# EAGLE design Attuino-v2a (EAGLE 7.3.0)
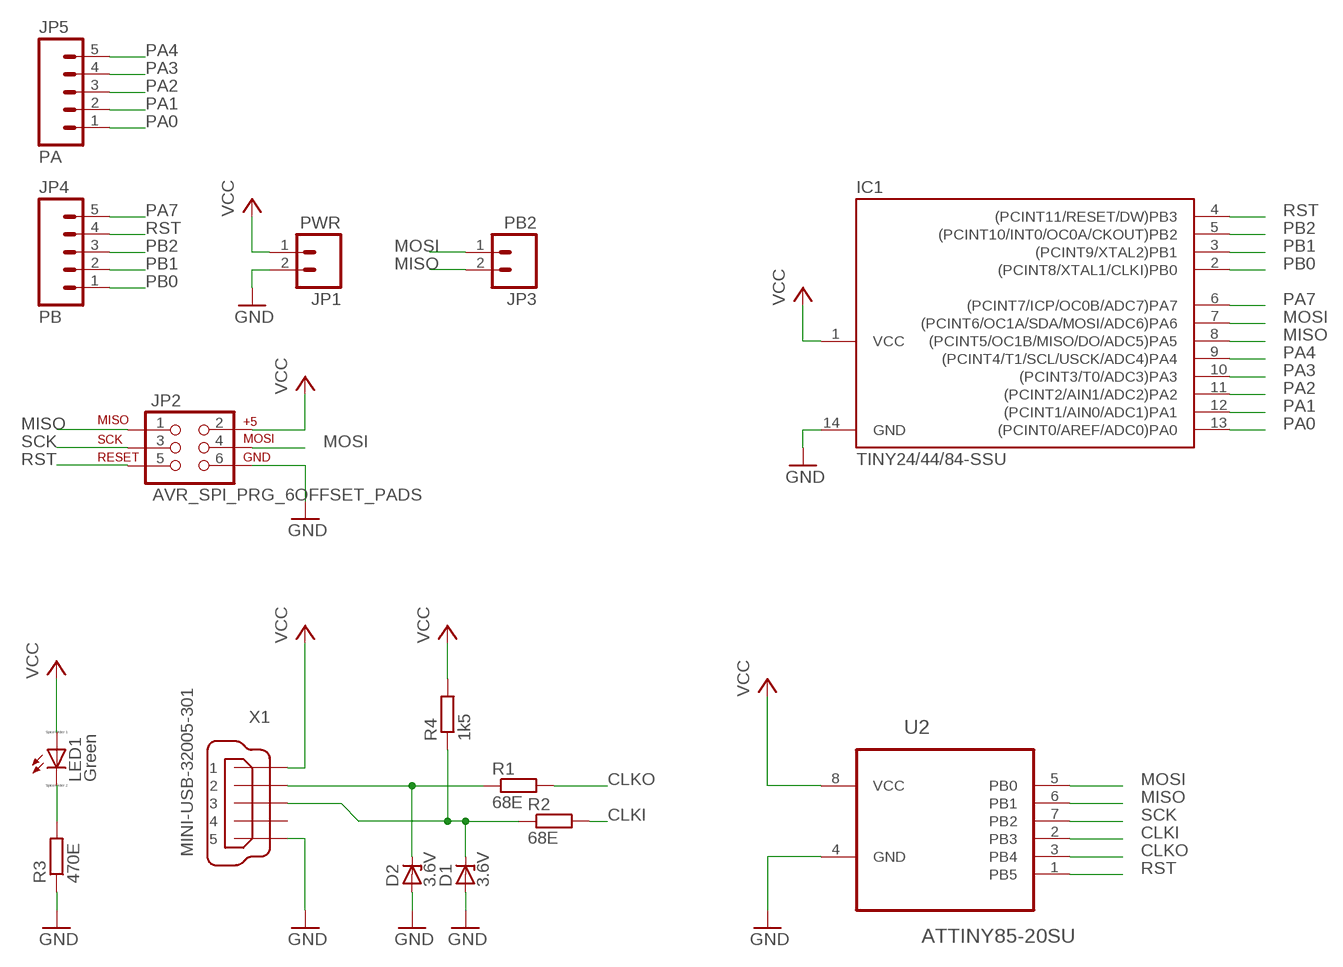
[diagram p0: schematic, sheet 1]

## Parts
D1  3.6V  ZENER-DIODESOD80C  [SOD80C]
D2  3.6V  ZENER-DIODESOD80C  [SOD80C]
IC1  TINY24/44/84-SSU  [SOIC14]
JP1  PWR  M021X02_NO_SILK  [1X02_NO_SILK]
JP2  AVR_SPI_PRG_6OFFSET_PADS  [2X3_OFFSET]
JP3  PB2  M021X02_NO_SILK  [1X02_NO_SILK]
JP4  PB  M05NO_SILK  [1X05_NO_SILK]
JP5  PA  M05NO_SILK  [1X05_NO_SILK]
LED1  Green  LED_E  [LED_1206]
R1  68E  R-EU_R0805  [R0805]
R2  68E  R-EU_R0805  [R0805]
R3  470E  R-EU_R0805  [R0805]
R4  1k5  R-EU_R0805  [R0805]
U2  ATTINY85-20SU  [SOIC127P798X216-8N]
X1  MINI-USB-32005-301  [32005-301]

## Nets
CLKI: R2.2 U2.2(PB3)
CLKO: R1.2 U2.3(PB4)
GND [Power]: D1.A D2.A IC1.14(GND) JP1.2 JP2.6 R3.1 U2.4(GND) X1.5
MISO: IC1.8((PCINT5/OC1B/MISO/DO/ADC5)PA5) JP2.1 JP3.2 U2.6(PB1)
MOSI: IC1.7((PCINT6/OC1A/SDA/MOSI/ADC6)PA6) JP2.4 JP3.1 U2.5(PB0)
N$1: D2.C R1.1 X1.2
N$2: D1.C R2.1 R4.1 X1.3
N$5: LED1.C R3.2
PA0: IC1.13((PCINT0/AREF/ADC0)PA0) JP5.1
PA1: IC1.12((PCINT1/AIN0/ADC1)PA1) JP5.2
PA2: IC1.11((PCINT2/AIN1/ADC2)PA2) JP5.3
PA3: IC1.10((PCINT3/T0/ADC3)PA3) JP5.4
PA4: IC1.9((PCINT4/T1/SCL/USCK/ADC4)PA4) JP5.5
PA7: IC1.6((PCINT7/ICP/OC0B/ADC7)PA7) JP4.5
PB0: IC1.2((PCINT8/XTAL1/CLKI)PB0) JP4.1
PB1: IC1.3((PCINT9/XTAL2)PB1) JP4.2
PB2: IC1.5((PCINT10/INT0/OC0A/CKOUT)PB2) JP4.3
RST: IC1.4((PCINT11/RESET/DW)PB3) JP2.5 JP4.4 U2.1(PB5)
SCK: JP2.3 U2.7(PB2)
VCC [Power]: IC1.1(VCC) JP1.1 JP2.2 LED1.A R4.2 U2.8(VCC) X1.1
Unconnected: X1.4

## Library data of the parts
D1 D2 = diode:ZENER-DIODE: Z-Diode
IC1 = avr-5:TINY24/44/84
JP1 JP3 = SparkFun-Connectors:M02: Standard 2-pin 0.1" header. Use with - straight break away headers ( PRT-00116) - right angle break away headers (PRT-00553) - swiss pins (PRT-00743) - machine pins (PRT-00117) - female headers (PRT-00115) Molex polarized connector foot print use with: PRT-08233 with associated crimp pins and housings. 2.54_SCREWTERM for use with PRT-10571. 3.5mm Screw Terminal footprints for PRT-08084 5mm Screw Terminal footprints for use with PRT-08432
JP2 = SparkFun-Connectors:AVR_SPI_PRG_6: AVR ISP 6 Pin This is the reduced ISP connector for AVR programming. Common on Arduino. This footprint will take up less PCB space and can be used with a 10-pin to 6-pin adapter such as SKU: BOB-08508 **Special note about "TEST_POINT" package. The stop mask is on the top side, so if you want your programming test points to be on the bottom of your board, make sure to place this package on the bottom side of the board. This also ensure that the orientation to program from the bottom side will be correct.
JP4 JP5 = SparkFun-Connectors:M05: Header 5 Standard 5-pin 0.1" header. Use with straight break away headers (SKU : PRT-00116), right angle break away headers (PRT-00553), swiss pins (PRT-00743), machine pins (PRT-00117), and female headers (PRT-00115). Molex polarized connector foot print use with SKU : PRT-08230 with associated crimp pins and housings.
LED1 = eagle-ltspice:LED_E: LED Source: http://www.osram.convergy.de Source: www.luxeon.com Source: www.kingbright.com; SPICEMODEL: NONE; SPICEPREFIX: D; SPICETYPE: diode
R1-R4 = rcl:R-EU_: RESISTOR, European symbol
U2 = Atmel_By_element14_Batch_1-00:ATTINY85-20SU: 8-bit Microcontroller with In-System Programmable Flash; MPN: ATTINY85-20SU; OC_FARNELL: 1455164; OC_NEWARK: 58M3797; PACKAGE: SOIC-8; SUPPLIER: Atmel
X1 = con-cypressindustries:MINI-USB-: MINI USB-B Conector Source: www.cypressindustries.com; OC_FARNELL: unknown; OC_NEWARK: unknown

## Net classes
0 default: width 0.305 mm, drill 0.584 mm, clearance 0.305 mm
1 Power: width 0.406 mm, drill 0.584 mm, clearance 0.406 mm

## Board
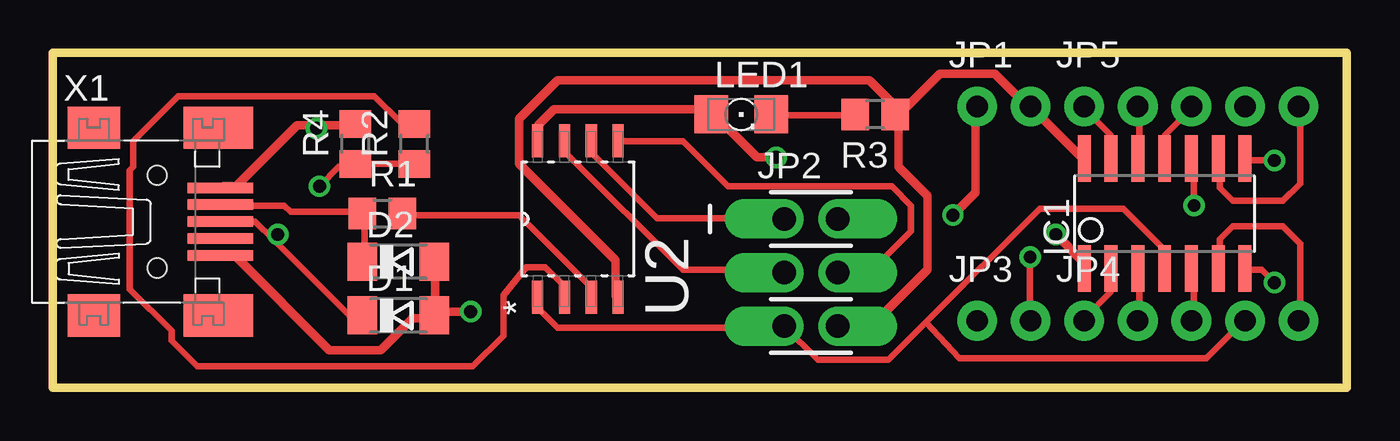
[diagram p1: board, top side]
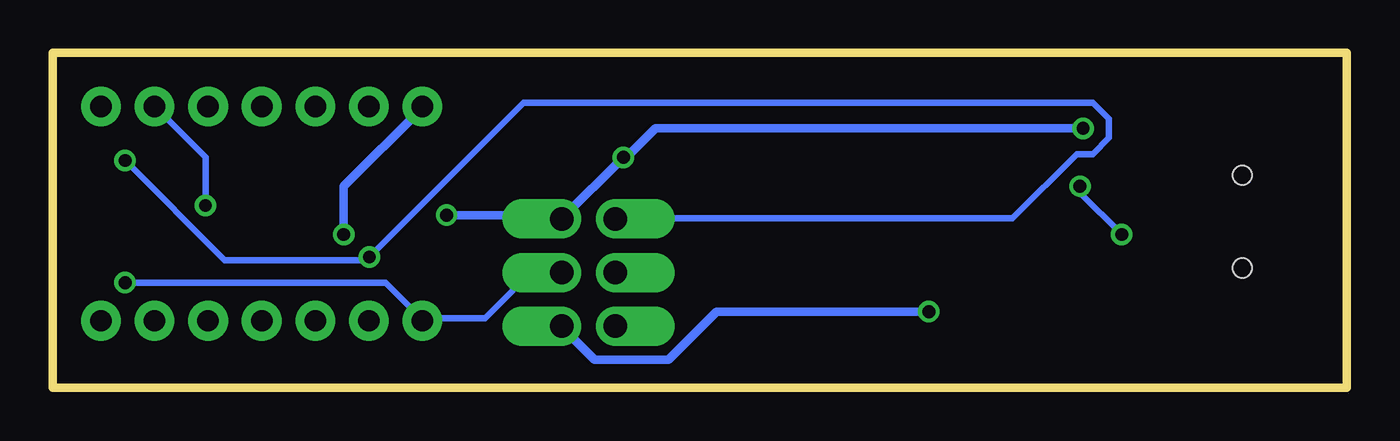
[diagram p2: board, bottom side, seen from below]

Size 61.34 x 15.88 mm. Coordinates in mm from the lower left corner, seen from the top.
Outline: 0,0 61.34,0 61.34,15.88 0,15.88 0,0
Copper layers (1*16): Top 0.035mm / dielectric 1.5mm / Bottom 0.035mm
Design rules "default *": minimum track width 12mil, minimum drill 24mil, track to track 12mil, track to pad 10mil, pad to pad 10mil, via to via 20mil, smd to smd 10mil, copper to edge 23mil, drill to drill 10mil, minimum pad ring 10mil, minimum via ring 8mil, stop-mask expansion 4mil, vias tented up to drill 0mil, thermal gap 10mil

### Footprints (pad centres in the part's own frame; a part is rotated, then mirrored left to right if it is on the bottom)
SOD80C = smd 1.4 x 1.8: A 1.7,0; C -1.7,0
SOIC14 = smd 0.61 x 2.21: 1 -3.81,-2.603; 2 -2.54,-2.603; 3 -1.27,-2.603; 4 0,-2.603; 5 1.27,-2.603; 6 2.54,-2.603; 7 3.81,-2.603; 8 3.81,2.603; 9 2.54,2.603; 10 1.27,2.603; 11 0,2.603; 12 -1.27,2.603; 13 -2.54,2.603; 14 -3.81,2.603
1X02_NO_SILK = drill 1.016 pad 1.88: 1 0,0; 2 2.54,0
2X3_OFFSET = drill 1.118 pad 1.88 offset: 1 -2.54,-1.27; 2 -2.54,1.27; 3 0,-1.27; 4 0,1.27; 5 2.54,-1.27; 6 2.54,1.27
1X05_NO_SILK = drill 1.016 pad 1.88: 1 0,0; 2 2.54,0; 3 5.08,0; 4 7.62,0; 5 10.16,0
LED_1206 = smd 1.6 x 1.803: A -1.422,0; C 1.422,0
R0805 = smd 1.3 x 1.5: 1 -0.95,0; 2 0.95,0
SOIC127P798X216-8N = smd 1.549 x 0.533: 1 -3.708,1.905; 2 -3.708,0.635; 3 -3.708,-0.635; 4 -3.708,-1.905; 5 3.708,-1.905; 6 3.708,-0.635; 7 3.708,0.635; 8 3.708,1.905
32005-301 = smd 3.1 x 0.5: 1 3,1.6; 2 3,0.8; 3 3,0; 4 3,-0.8; 5 3,-1.6 | smd 2.5 x 2: M1 -3,-4.45; M2 -3,4.45 | smd 3.3 x 2: M3 2.9,4.45; M4 2.9,-4.45 | hole 0.9: 0,2.2; 0,-2.2

### Placement (x,y rotation side)
D1  16.38,3.43 0 top
D2  16.38,5.97 0 top
IC1  52.7,8.26 0 top
JP1  43.81,13.34 0 top
JP2  35.94,5.46 270 top
JP3  43.81,3.18 0 top
JP4  48.9,3.18 0 top
JP5  48.9,13.34 0 top
LED1  32.64,12.95 0 top
R1  15.62,8.26 0 top
R2  17.14,11.56 90 top
R3  38.99,12.95 180 top
R4  14.35,11.56 90 top
U2  24.89,8 90 top
X1  4.95,7.87 0 top

### Tracks (layer width: path | path; a pad name or v marks a point on that pad's centre or on a via)
CLKI
  Top 0.305: R2.2 17.07,12.6 16.46,12.6 15.24,13.82 5.94,13.82 3.81,11.68 3.81,10.46 3.66,10.31 3.66,4.67 5.64,2.69 5.64,2.23 6.86,1.02 19.91,1.02 21.36,2.46 21.36,4.39 22.43,5.71 23.34,5.71 24.23,4.83 24.23,4.37 U2.2
CLKO
  Top 0.305: R1.2 16.61,8.18 22.1,8.18 25.45,4.83 25.45,4.37 U2.3
GND  (via drill 0.61)
  Top 0.406: D1.A 18.14,3.45 18.14,5.89 D2.A | D1.A 17.98,3.3 17.07,3.3 15.54,1.78 13.11,1.78 8.69,6.2 8.08,6.2 X1.5 | R3.1 40.08,12.9 40.08,10.46 41.45,9.09 41.45,5.59 38.86,3 37.34,3 JP2.6 | U2.4 26.67,4.37 26.67,6.04 22.1,10.62 22.1,12.75 23.93,14.58 38.71,14.58 39.78,13.51 39.78,13.06 R3.1 | v19.81,3.61 18.29,3.61 D1.A | IC1.14 48.77,10.92 JP1.2 46.18,13.36 44.65,14.88 42.06,14.88 40.23,13.06 R3.1
  Bottom 0.406: v19.81,3.61 29.87,3.61 32.16,1.32 35.66,1.32 37.19,2.85 JP2.6
MISO  (via drill 0.61)
  Top 0.305: U2.6 25.6,11.68 25.6,11.07 28.65,8.03 34.59,8.03 JP2.1 | v57.91,10.77 56.54,10.77 IC1.8 | v46.33,6.2 46.33,3.3 JP3.2
  Bottom 0.305: v57.91,10.77 53.19,6.04 46.48,6.04 v46.33,6.2 39.01,13.51 12.04,13.51 11.28,12.75 11.28,11.84 12.04,11.07 12.8,11.07 15.85,8.03 34.59,8.03 JP2.1
MOSI  (via drill 0.61)
  Top 0.305: U2.5 26.82,11.68 29.87,11.68 32,9.55 39.78,9.55 40.69,8.64 40.69,7.42 38.86,5.59 37.34,5.59 JP2.4 | v57.91,4.98 57.3,5.59 56.54,5.59 IC1.7
  Bottom 0.305: v57.91,4.98 45.57,4.98 43.89,3.3 JP3.1 43.74,3.3 40.84,3.3 38.71,5.44 37.34,5.44 JP2.4
N$1
  Top 0.305: D2.C 14.78,6.04 14.78,8.18 R1.1 14.63,8.33 11.28,8.33 10.97,8.64 8.08,8.64 X1.2
N$2  (via drill 0.61)
  Top 0.305: R2.1 17.07,10.62 14.48,10.62 R4.1 14.33,10.46 13.56,10.46 v12.65,9.55 | 10.44,7.04 9.6,7.87 X1.3 | 10.44,7.04 14.02,3.45 14.63,3.45 D1.C | 10.44,7.04 v10.67,7.26
  Bottom 0.305: v12.65,9.55 12.65,9.25 v10.67,7.26
N$5
  Top 0.305: R3.2 37.95,12.9 34.14,12.9 LED1.C
PA0
  Top 0.305: IC1.13 50.14,10.92 50.14,11.99 48.92,13.21 JP5.1
PA1
  Top 0.305: IC1.12 51.51,10.92 51.51,13.21 JP5.2
PA2
  Top 0.305: IC1.11 52.73,10.92 52.73,11.99 53.95,13.21 JP5.3
PA3  (via drill 0.61)
  Top 0.305: v54.1,8.64 54.1,10.77 IC1.10
  Bottom 0.305: v54.1,8.64 54.1,10.92 JP5.4
PA4
  Top 0.305: IC1.9 55.32,10.77 55.32,9.47 55.93,8.87 58.32,8.87 59.13,9.68 59.13,13.21 JP5.5
PA7
  Top 0.305: IC1.6 55.32,5.74 55.32,7.04 55.93,7.64 58.32,7.64 59.13,6.83 59.13,3.3 JP4.5
PB0
  Top 0.305: IC1.2 50.14,5.59 50.14,4.52 48.92,3.3 JP4.1
PB1
  Top 0.305: IC1.3 51.51,5.59 51.51,3.3 JP4.2
PB2
  Top 0.305: IC1.5 54.1,5.59 54.1,3.3 JP4.3
RST
  Top 0.305: U2.1 23.01,4.22 23.01,3.76 23.93,2.85 34.59,2.85 JP2.5 36.27,1.32 39.62,1.32 41.4,3.1 | 41.4,3.1 46.79,8.48 50.75,8.48 52.58,6.65 52.58,5.74 IC1.4 | 41.4,3.1 42.98,1.4 54.69,1.4 56.44,3.15 56.39,3.15 JP4.4
SCK
  Top 0.305: U2.7 24.38,11.68 24.38,11.07 29.87,5.59 34.59,5.59 JP2.3
VCC  (via drill 0.61)
  Top 0.406: 12.5,12.45 11.58,12.45 8.69,9.55 8.08,9.55 X1.1 | 12.5,12.45 14.33,12.45 R4.2 | U2.8 23.01,11.84 23.01,12.45 23.77,13.21 30.94,13.21 31.09,13.06 LED1.A 31.39,12.9 33.38,10.92 v34.29,10.92 | v12.5,12.29 12.5,12.45 | v47.55,7.26 48.77,6.04 48.77,5.74 IC1.1 | v42.67,8.18 43.74,9.25 43.74,13.21 JP1.1
  Bottom 0.406: v12.5,12.29 32.77,12.29 34.14,10.92 v34.29,10.92 JP2.2 37.19,8.18 v42.67,8.18 | v47.55,7.26 47.55,9.55 43.89,13.21 JP1.1